# EAGLE design avr_pong (EAGLE 7.2.0)
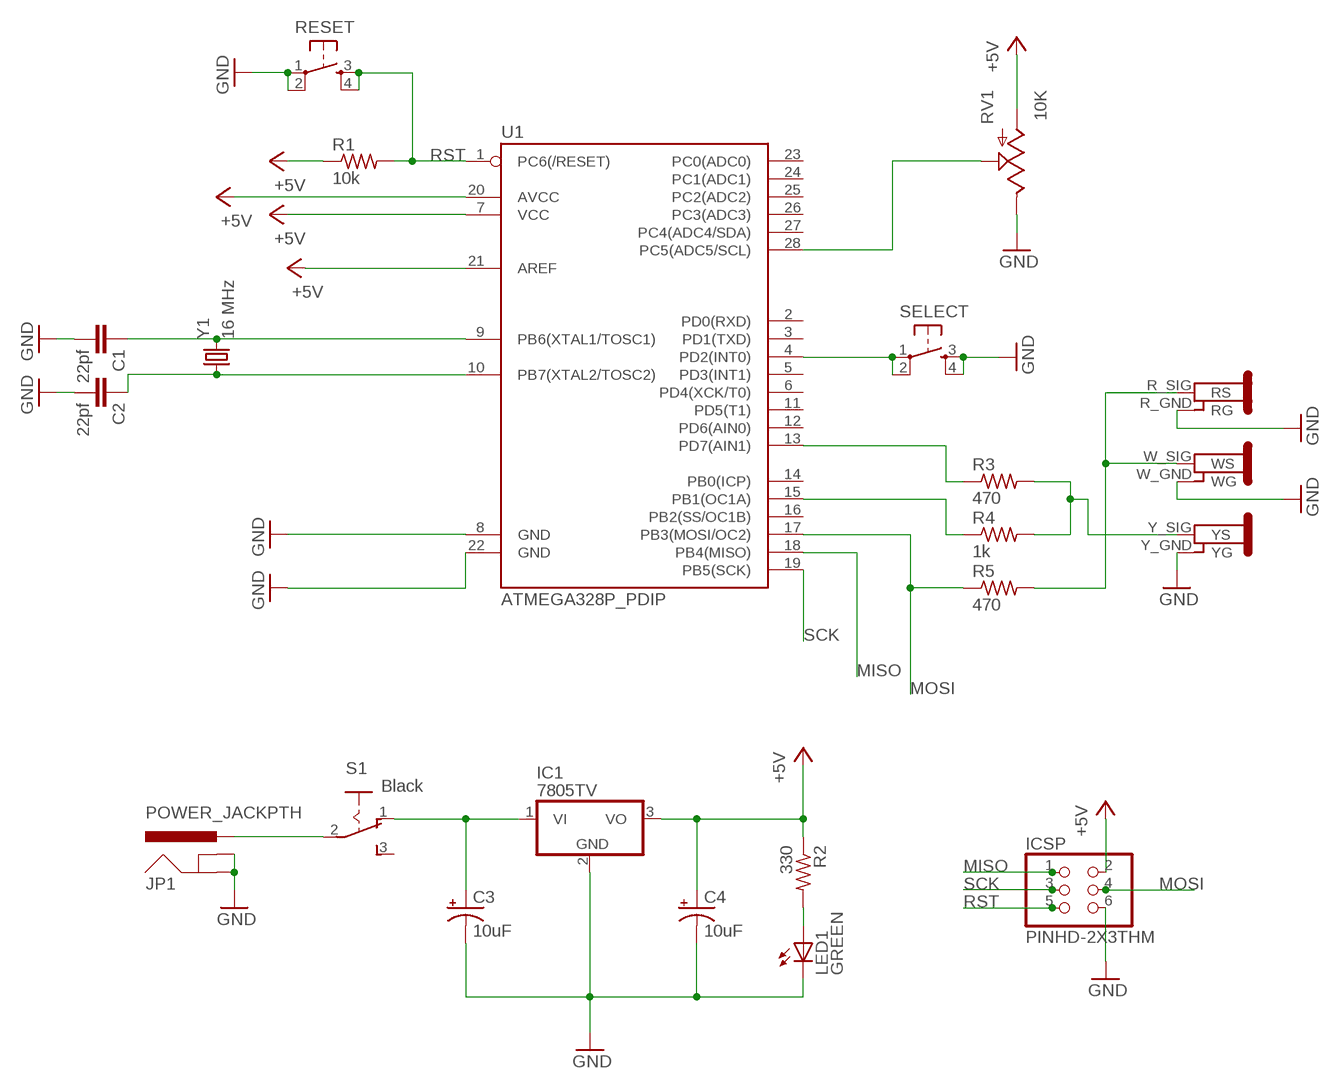
[diagram p0: schematic, sheet 1]

## Parts
C1  22pf  CAPKIT  [CAP-PTH-SMALL-KIT]
C2  22pf  CAPKIT  [CAP-PTH-SMALL-KIT]
C3  10uF  CPOL-USE2.5-5  [E2,5-5]
C4  10uF  CPOL-USE2.5-5  [E2,5-5]
IC1  7805TV  [TO220V]
ICSP  PINHD-2X3THM  [ISP6]
JP1  POWER_JACKPTH  [POWER_JACK_PTH]
LED1  GREEN  LED5MM  [LED5MM]
R1  10k  R-US_0207/10  [0207/10]
R2  330  R-US_0207/10  [0207/10]
R3  470  R-US_0207/10  [0207/10]
R4  1k  R-US_0207/10  [0207/10]
R5  470  R-US_0207/10  [0207/10]
RESET  TACTILE-SWITCH-PTH  [TAC-SWITCH-PTH]
RV1  10K  POT-RV16AF-20  [POT_ALPHA_RV16AF-20]
S1  Black  M251  [M251]
SELECT  TACTILE-SWITCH-PTH  [TAC-SWITCH-PTH]
U1  ATMEGA328P_PDIP  [DIL28-3]
U$1  3-RCA-JACK  [3-RCA-JACK]
Y1  16 MHz  CRYSTALHC49US  [HC49US]

## Nets
+5V: C4.+ IC1.3(VO) ICSP.2 R1.1 R2.1 RV1.1(A) U1.7(VCC) U1.20(AVCC) U1.21(AREF)
GND: C1.2 C2.2 C3.- C4.- IC1.2(GND) ICSP.6 JP1.GND JP1.GNDBREAK LED1.K(C) RESET.1 RESET.2 RV1.3(E) SELECT.3 SELECT.4 U1.8(GND) U1.22(GND) U$1.R_GND(RG) U$1.W_GND(WG) U$1.Y_GND(YG)
MISO: ICSP.1 U1.18(PB4(MISO))
MOSI: ICSP.4 R5.1 U1.17(PB3(MOSI/OC2))
N$1: C1.1 U1.9(PB6(XTAL1/TOSC1)) Y1.2
N$2: C2.1 U1.10(PB7(XTAL2/TOSC2)) Y1.1
N$3: R5.2 U$1.R_SIG(RS) U$1.W_SIG(WS)
N$4: LED1.A R2.2
N$5: C3.+ IC1.1(VI) S1.1(O)
N$6: JP1.PWR S1.2(P)
N$7: RV1.2(S) U1.28(PC5(ADC5/SCL))
N$8: SELECT.1 SELECT.2 U1.4(PD2(INT0))
N$10: R3.1 U1.13(PD7(AIN1))
N$11: R4.1 U1.15(PB1(OC1A))
N$12: R3.2 R4.2 U$1.Y_SIG(YS)
RST: ICSP.5 R1.2 RESET.3 RESET.4 U1.1(PC6(/RESET))
SCK: ICSP.3 U1.19(PB5(SCK))
Unconnected: S1.3(S) U1.2(PD0(RXD)) U1.3(PD1(TXD)) U1.5(PD3(INT1)) U1.6(PD4(XCK/T0)) U1.11(PD5(T1)) U1.12(PD6(AIN0)) U1.14(PB0(ICP)) U1.16(PB2(SS/OC1B)) U1.23(PC0(ADC0)) U1.24(PC1(ADC1)) U1.25(PC2(ADC2)) U1.26(PC3(ADC3)) U1.27(PC4(ADC4/SDA))

## Library data of the parts
C1 C2 = SparkFun-Capacitors:CAP: Capacitor Standard 0603 ceramic capacitor, and 0.1" leaded capacitor.
C3 C4 = rcl:CPOL-US: POLARIZED CAPACITOR, American symbol
IC1 = linear:78*: Positive VOLTAGE REGULATOR Source: http://cache.national.com/ds/LM/LM78L05.pdf http://www.fairchildsemi.com/ds/LM/LM7805.pdf
ICSP = adaprog:PINHD-2X3
JP1 = SparkFun-Connectors:POWER_JACK: Power Jack This is the standard 5.5mm barrel jack for power. The PTH is the most common, proven, reliable, footprint. The Slot footprint only works if the mill layer is transmitted to the PCB fab house so be warned. Mating wall wart : TOL-00298 (and others); PROD_ID: CONN-08197
LED1 = led:LED: LED OSRAM: - CHIPLED LG R971, LG N971, LY N971, LG Q971, LY Q971, LO R971, LY R971 LH N974, LH R974 LS Q976, LO Q976, LY Q976 LO Q996 - Hyper CHIPLED LW Q18S LB Q993, LB Q99A, LB R99A - SideLED LS A670, LO A670, LY A670, LG A670, LP A670 LB A673, LV A673, LT A673, LW A673 LH A674 LY A675 LS A676, LA A676, LO A676, LY A676, LW A676 LS A679, LY A679, LG A679 - Hyper Micro SIDELED® LS Y876, LA Y876, LO Y876, LY Y876 LT Y87S - SmartLED LW L88C, LW L88S LB L89C, LB L89S, LG L890 LS L89K, LO L89K, LY L89K LS L896, LA L896, LO L896, LY L896 - TOPLED LS T670, LO T670, LY T670, LG T670, LP T670 LSG T670, LSP T670, LSY T670, LOP T670, LYG T670 LG T671, LOG T671, LSG T671 LB T673, LV T673, LT T673, LW T673 LH T674 LS T676, LA T676, LO T676, LY T676, LB T676, LH T676, LSB T676, LW T676 LB T67C, LV T67C, LT T67C, LS T67K, LO T67K, LY T67K, LW E67C LS E67B, LA E67B, LO E67B, LY E67B, LB E67C, LV E67C, LT E67C LW T67C LS T679, LY T679, LG T679 LS T770, LO T770, LY T770, LG T770, LP T770 LB T773, LV T773, LT T773, LW T773 LH T774 LS E675, LA E675, LY E675, LS T675 LS T776, LA T776, LO T776, LY T776, LB T776 LHGB T686 LT T68C, LB T68C - Hyper Mini TOPLED® LB M676 - Mini TOPLED Santana® LG M470 LS M47K, LO M47K, LY M47K Source: http://www.osram.convergy.de LUXEON: - LUMILED® LXK2-PW12-R00, LXK2-PW12-S00, LXK2-PW14-U00, LXK2-PW14-V00 LXK2-PM12-R00, LXK2-PM12-S00, LXK2-PM14-U00 LXK2-PE12-Q00, LXK2-PE12-R00, LXK2-PE12-S00, LXK2-PE14-T00, LXK2-PE14-U00 LXK2-PB12-K00, LXK2-PB12-L00, LXK2-PB12-M00, LXK2-PB14-N00, LXK2-PB14-P00, LXK2-PB14-Q00 LXK2-PR12-L00, LXK2-PR12-M00, LXK2-PR14-Q00, LXK2-PR14-R00 LXK2-PD12-Q00, LXK2-PD12-R00, LXK2-PD12-S00 LXK2-PH12-R00, LXK2-PH12-S00 LXK2-PL12-P00, LXK2-PL12-Q00, LXK2-PL12-R00 Source: www.luxeon.com KINGBRIGHT: KA-3528ASYC Source: www.kingbright.com
R1-R5 = rcl:R-US_: RESISTOR, American symbol
RESET SELECT = GeekAmmo:TACTILE-SWITCH: Tactile Switch 4 Pins, SPST NO
RV1 = SparkFun-Electromechanical:POT
S1 = switch:M251: SLIDING SWITCH Mors, distributor Buerklin, 11G702
U1 = SparkFun-DigitalIC:ATMEGA328P_PDIP: uC used in the Arduino 32kb flash, 1k EEPROM, 2k SRAM This is the through-hole version of this chip.
U$1 = 3-rca-jack:3-RCA-JACK
Y1 = SparkFun-FreqCtrl:CRYSTAL: Various standard crystals. Proven footprints.

## Board
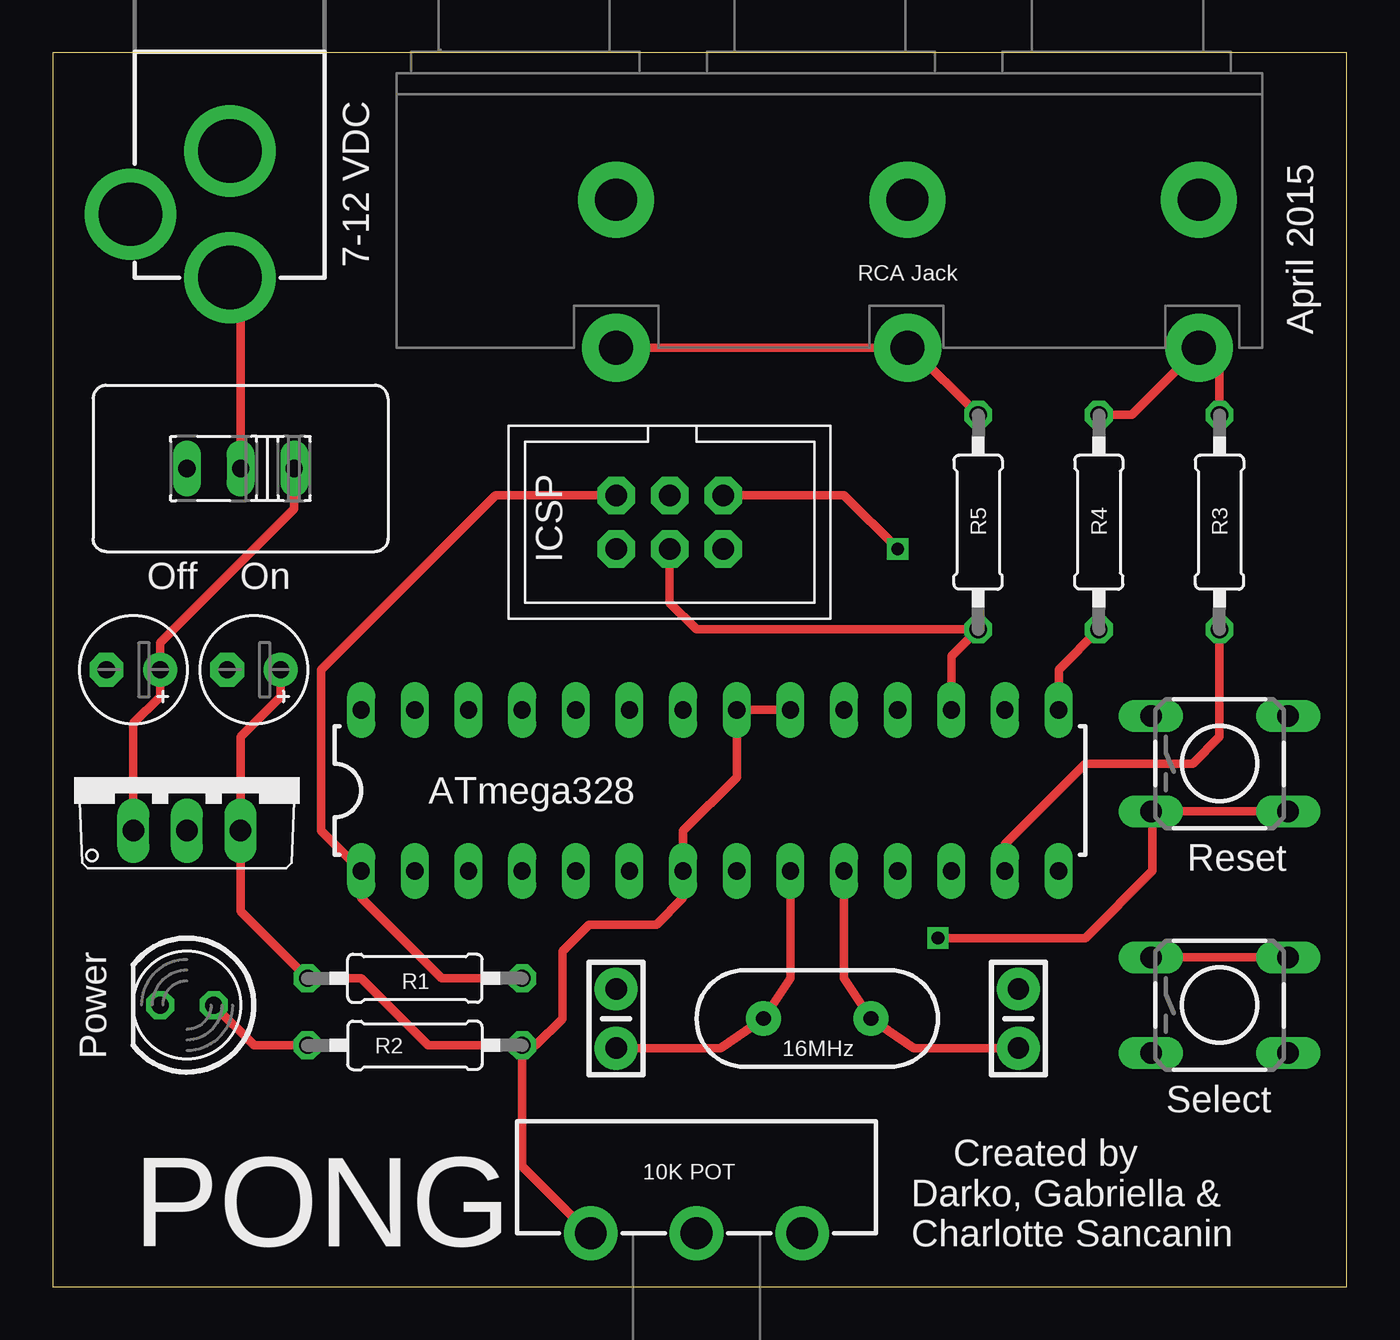
[diagram p1: board, top side]
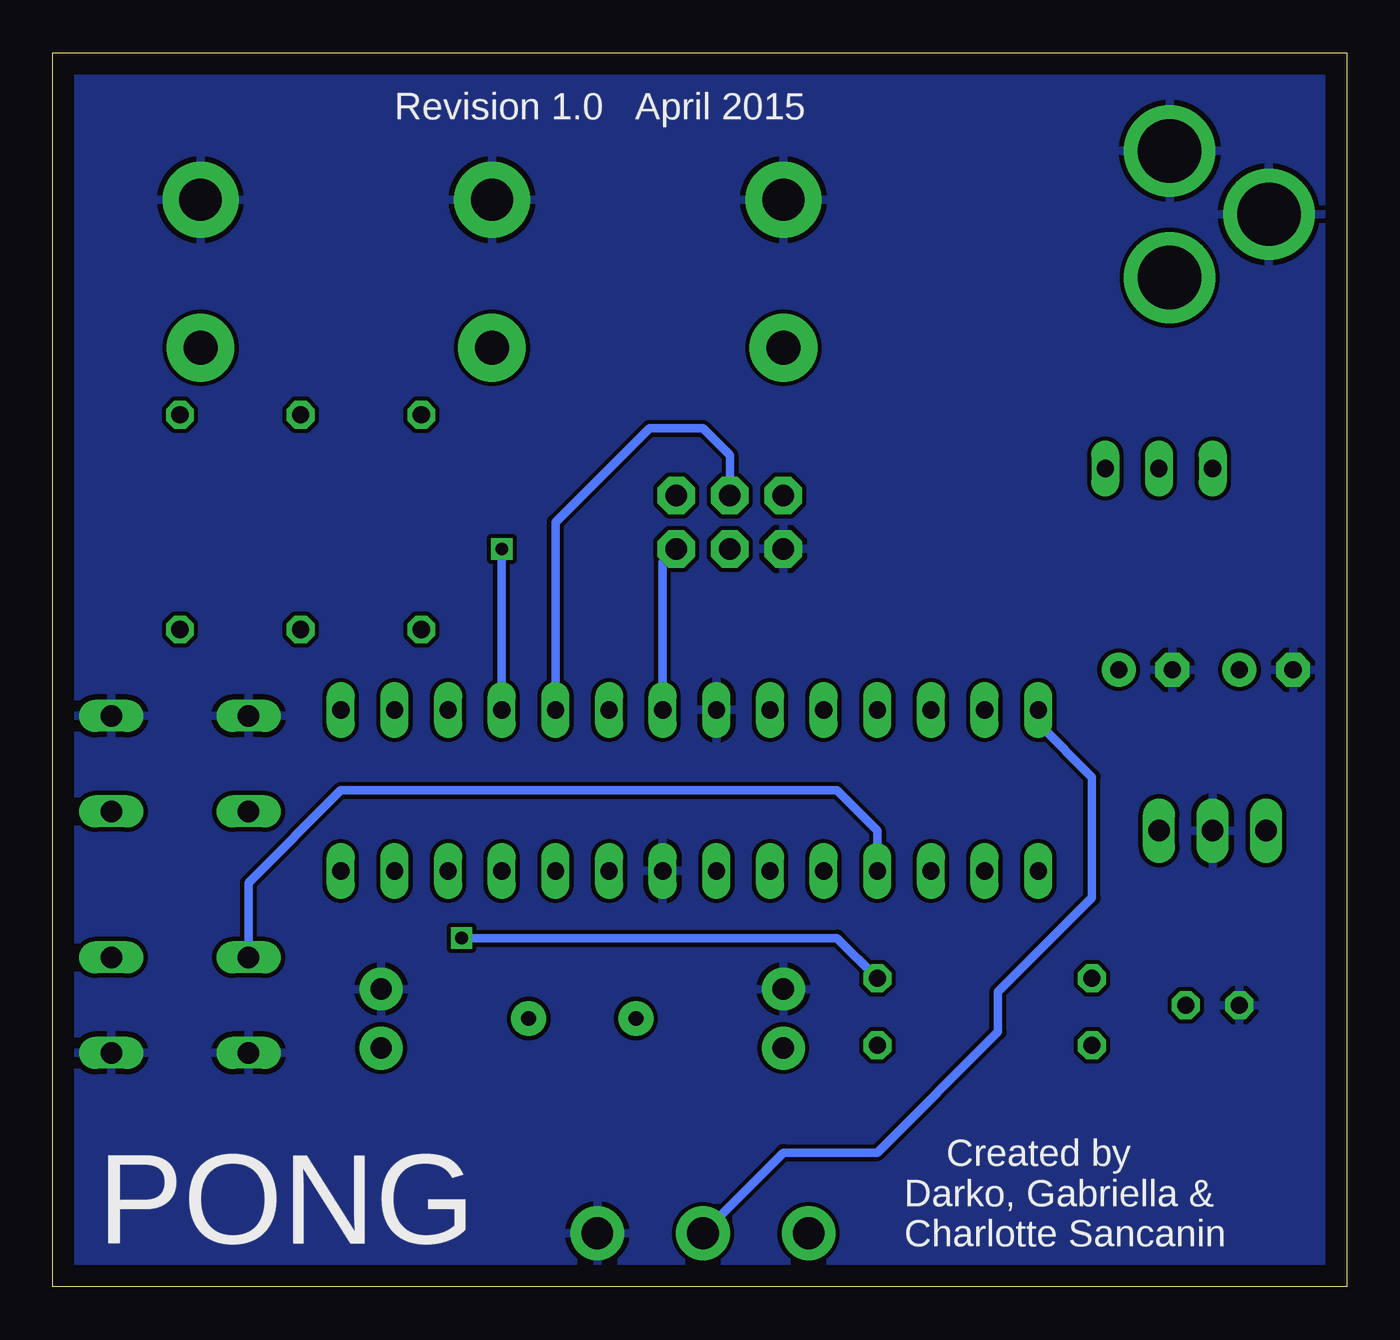
[diagram p2: board, bottom side, seen from below]

Size 61.27 x 58.41 mm. Coordinates in mm from the lower left corner, seen from the top.
Outline: 0,0 61.27,0 61.27,58.41 0,58.41 0,0
Copper layers (1*16): Top 0.035mm / dielectric 1.5mm / Bottom 0.035mm
Design rules "default": minimum track width 10mil, minimum drill 24mil, track to track 8mil, track to pad 8mil, pad to pad 8mil, via to via 8mil, smd to smd 8mil, copper to edge 40mil, drill to drill 8mil, minimum pad ring 10mil, minimum via ring 8mil, stop-mask expansion 4mil, vias tented up to drill 0mil, thermal gap 10mil

### Footprints (pad centres in the part's own frame; a part is rotated, then mirrored left to right if it is on the bottom)
CAP-PTH-SMALL-KIT = drill 1.016 pad 2.032: 1 -1.397,0; 2 1.397,0
E2,5-5 = drill 0.813 pad 1.6: + -1.27,0 | drill 0.813 pad 1.6 octagon: - 1.27,0
TO220V = drill 1.016 long: 1 -2.54,-2.54; 2 0,-2.54; 3 2.54,-2.54
ISP6 = drill 1.016 pad 1.778 octagon: 1 -2.54,-1.27; 2 -2.54,1.27; 3 0,-1.27; 4 0,1.27; 5 2.54,-1.27; 6 2.54,1.27
POWER_JACK_PTH = drill 2.997 pad 4.318: GND 0,7.7; GNDBREAK 4.7,10.7; PWR 0,13.7
LED5MM = drill 0.813 octagon: A -1.27,0; K 1.27,0
0207/10 = drill 0.813 octagon: 1 -5.08,0; 2 5.08,0
TAC-SWITCH-PTH = drill 1.016 pad 1.524 long: 1 -3.251,2.261; 2 3.251,2.261; 3 -3.251,-2.261; 4 3.251,-2.261
POT_ALPHA_RV16AF-20 = drill 1.5 pad 2.54: 1 -5,0; 2 0,0; 3 5,0
M251 = drill 0.813 long: 1 -2.54,0; 2 0,0; 3 2.54,0
DIL28-3 = drill 0.813 long: 1 -16.51,-3.81; 2 -13.97,-3.81; 3 -11.43,-3.81; 4 -8.89,-3.81; 5 -6.35,-3.81; 6 -3.81,-3.81; 7 -1.27,-3.81; 8 1.27,-3.81; 9 3.81,-3.81; 10 6.35,-3.81; 11 8.89,-3.81; 12 11.43,-3.81; 13 13.97,-3.81; 14 16.51,-3.81; 15 16.51,3.81; 16 13.97,3.81; 17 11.43,3.81; 18 8.89,3.81; 19 6.35,3.81; 20 3.81,3.81; 21 1.27,3.81; 22 -1.27,3.81; 23 -3.81,3.81; 24 -6.35,3.81; 25 -8.89,3.81; 26 -11.43,3.81; 27 -13.97,3.81; 28 -16.51,3.81
3-RCA-JACK = drill 2 pad 3.6: R_GND 0,7; W_GND 13.8,7; Y_GND 27.6,7 | drill 1.6 pad 3.2: R_SIG 0,0; W_SIG 13.8,0; Y_SIG 27.6,0
HC49US = drill 0.7 pad 1.651: 1 -2.54,0; 2 2.54,0

### Placement (x,y rotation side)
C1  26.67,12.7 90 top
C2  45.72,12.7 90 top
C3  3.81,29.21 180 top
C4  9.53,29.21 180 top
IC1  6.35,24.13 0 top
ICSP  29.21,36.2 180 top
JP1  8.38,61.47 180 top
LED1  6.35,13.34 180 top
R1  17.14,14.61 0 top
R2  17.14,11.43 180 top
R3  55.24,36.2 90 top
R4  49.53,36.2 90 top
R5  43.81,36.2 90 top
RESET  55.24,24.77 0 top
RV1  30.48,2.54 0 top
S1  8.89,38.73 180 top
SELECT  55.24,13.34 0 top
U1  31.11,23.5 0 top
U$1  26.67,44.45 0 top
Y1  36.2,12.7 180 top

### Tracks (layer width: path | path; a pad name or v marks a point on that pad's centre or on a via)
+5V
  Top 0.406: RV1.1 25.4,2.54 22.23,5.71 R2.1 | U1.20 U1.21 32.38,24.13 29.84,21.59 U1.7 29.84,18.41 28.57,17.14 25.4,17.14 24.13,15.88 24.13,12.7 22.86,11.43 R2.1 | R2.1 17.78,11.43 14.61,14.61 R1.1 8.89,17.78 IC1.3 8.89,26.04 10.79,27.94 C4.+
  Bottom 0.406: U1.21 32.38,34.29 ICSP.2
GND
  pour Bottom: 0,58.42 0,0 60.96,0 61.59,0 61.59,58.42
MISO  (via drill 0.6)
  Top 0.406: v40.01,34.92 37.47,37.47 ICSP.1
  Bottom 0.406: U1.18 v40.01,34.92
MOSI
  Top 0.406: ICSP.4 29.21,32.38 30.48,31.11 R5.1 42.55,29.84 U1.17
N$1
  Top 0.406: U1.9 34.92,14.61 Y1.2 31.62,11.3 C1.1
N$2
  Top 0.406: U1.10 37.47,14.61 Y1.1 40.77,11.3 C2.1
N$3
  Top 0.406: U$1.R_SIG U$1.W_SIG 40.64,44.45 R5.2
N$4
  Top 0.406: R2.2 9.53,11.43 LED1.A
N$5
  Top 0.406: IC1.1 3.81,26.67 5.08,27.94 C3.+ 5.08,30.48 11.43,36.83 S1.1
N$6
  Top 0.406: S1.2 8.89,47.26 JP1.PWR
N$7
  Bottom 0.406: RV1.2 26.67,6.35 22.23,6.35 16.51,12.06 16.51,13.97 12.06,18.41 12.06,24.13 14.61,26.67 U1.28
N$8
  Top 0.406: SELECT.2 SELECT.1
  Bottom 0.406: SELECT.1 51.99,19.13 47.62,23.5 24.13,23.5 22.23,21.59 U1.4
N$10
  Top 0.406: R3.1 55.24,26.04 53.98,24.77 48.9,24.77 45.09,20.95 U1.13
N$11
  Top 0.406: U1.15 47.62,29.21 R4.1
N$12
  Top 0.406: R3.2 55.24,43.48 U$1.Y_SIG 51.09,41.27 R4.2
RST  (via drill 0.6)
  Top 0.406: R1.2 18.41,14.61 14.61,18.41 U1.1 12.7,21.59 12.7,29.21 20.95,37.47 ICSP.5 | v41.91,16.51 48.9,16.51 52.07,19.68 52.07,22.43 RESET.3 RESET.4
  Bottom 0.406: v41.91,16.51 24.13,16.51 R1.2
SCK
  Bottom 0.406: U1.19 37.47,36.2 33.02,40.64 30.48,40.64 29.21,39.37 ICSP.3

### Text on the board
tPlace: 7-12 VDC | RCA Jack | April 2015 | R5 | R4 | R3 | ICSP | Off On | ATmega328 | Reset | R1 | Power | R2 | 16MHz | Select | 10K POT | PONG | Created by / Darko, Gabriella & / Charlotte Sancanin
bPlace: Revision 1.0 April 2015 | PONG | Created by / Darko, Gabriella & / Charlotte Sancanin